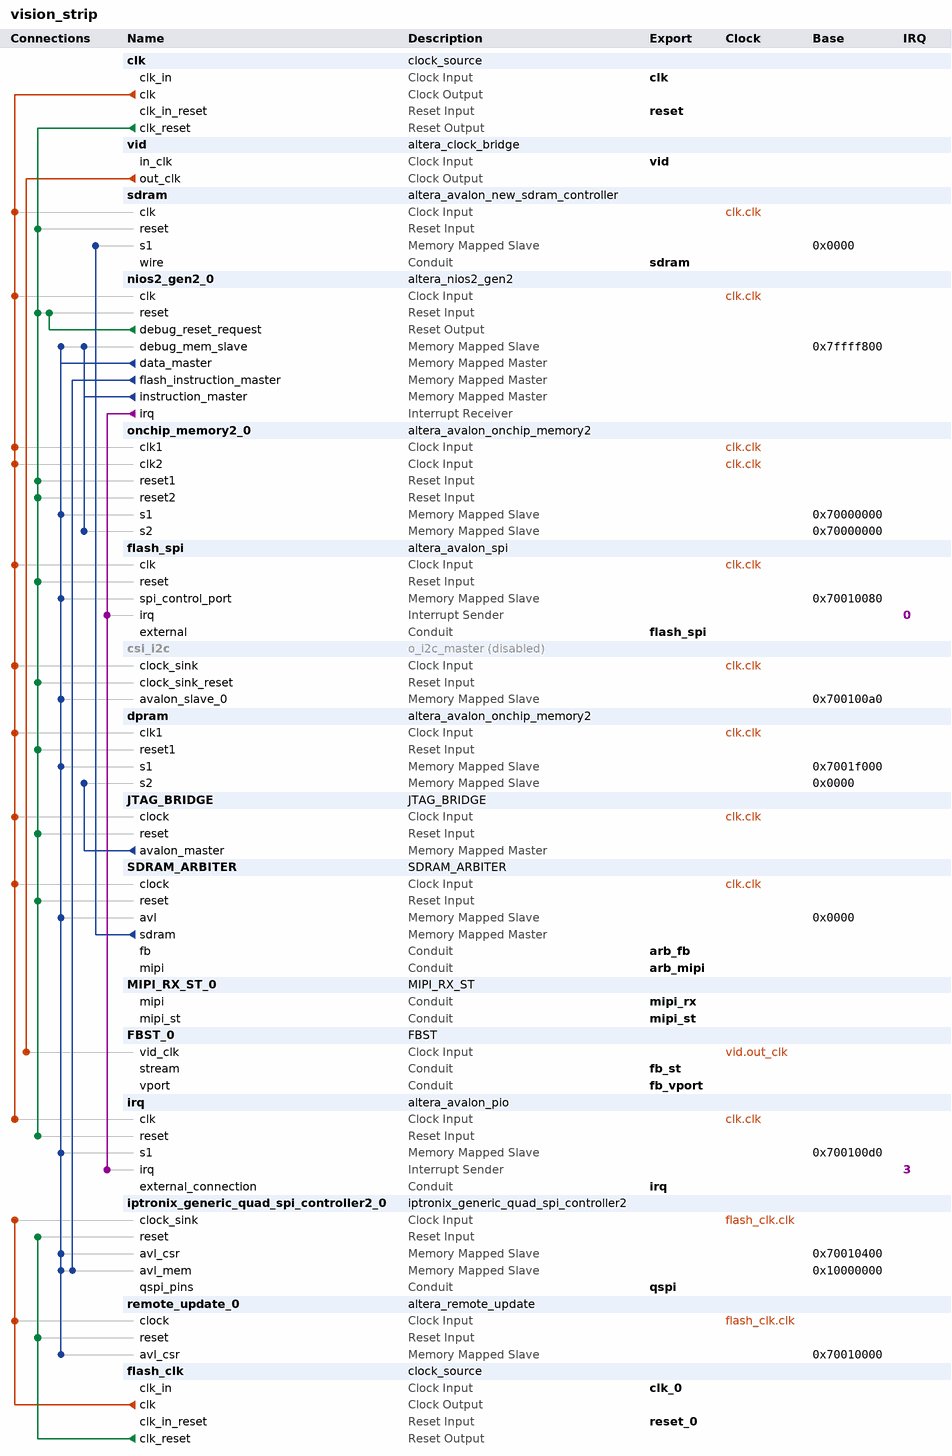
[diagram p0: system contents]
# Platform Designer (Qsys) system vision_strip, Cyclone 10 LP 10CL016YU256C8G
# Parameters at their usual value, and those the tool derives, are not listed.
package require -exact qsys 18.0
create_system vision_strip
set_project_property DEVICE_FAMILY {Cyclone 10 LP}
set_project_property DEVICE 10CL016YU256C8G

add_instance clk clock_source 18.0
set_instance_parameter_value clk clockFrequency 100000000

add_instance vid altera_clock_bridge 18.0
set_instance_parameter_value vid DERIVED_CLOCK_RATE 0
set_instance_parameter_value vid EXPLICIT_CLOCK_RATE 0

add_instance sdram altera_avalon_new_sdram_controller 18.0
set_instance_parameter_value sdram TAC 5.4
set_instance_parameter_value sdram TRCD 20.0
set_instance_parameter_value sdram TRP 20.0
set_instance_parameter_value sdram casLatency 2
set_instance_parameter_value sdram columnWidth 8
set_instance_parameter_value sdram dataWidth 16
set_instance_parameter_value sdram generateSimulationModel false
set_instance_parameter_value sdram model single_Micron_MT48LC4M32B2_7_chip
set_instance_parameter_value sdram numberOfBanks 4
set_instance_parameter_value sdram numberOfChipSelects 1
set_instance_parameter_value sdram powerUpDelay 200.0
set_instance_parameter_value sdram refreshPeriod 31.25
set_instance_parameter_value sdram rowWidth 12

add_instance nios2_gen2_0 altera_nios2_gen2 18.0
set_instance_parameter_value nios2_gen2_0 dcache_size 1024
set_instance_parameter_value nios2_gen2_0 debug_hwbreakpoint 4
set_instance_parameter_value nios2_gen2_0 exceptionSlave onchip_memory2_0.s2
set_instance_parameter_value nios2_gen2_0 fa_cache_linesize 16
set_instance_parameter_value nios2_gen2_0 icache_size 1024
set_instance_parameter_value nios2_gen2_0 impl Fast
set_instance_parameter_value nios2_gen2_0 resetSlave onchip_memory2_0.s2

add_instance onchip_memory2_0 altera_avalon_onchip_memory2 18.0
set_instance_parameter_value onchip_memory2_0 dataWidth 32
set_instance_parameter_value onchip_memory2_0 dualPort true
set_instance_parameter_value onchip_memory2_0 initMemContent true
set_instance_parameter_value onchip_memory2_0 initializationFileName onchip_mem.hex
set_instance_parameter_value onchip_memory2_0 memorySize 16384

add_instance flash_spi altera_avalon_spi 18.0
set_instance_parameter_value flash_spi clockPolarity 0
set_instance_parameter_value flash_spi dataWidth 8
set_instance_parameter_value flash_spi masterSPI true
set_instance_parameter_value flash_spi numberOfSlaves 1
set_instance_parameter_value flash_spi targetClockRate 50000000

add_instance csi_i2c o_i2c_master 1.0
set_instance_property csi_i2c ENABLED false

add_instance dpram altera_avalon_onchip_memory2 18.0
set_instance_parameter_value dpram dataWidth 32
set_instance_parameter_value dpram dualPort true
set_instance_parameter_value dpram initMemContent true
set_instance_parameter_value dpram initializationFileName onchip_mem.hex
set_instance_parameter_value dpram memorySize 1024
set_instance_parameter_value dpram singleClockOperation true

add_instance JTAG_BRIDGE JTAG_BRIDGE 1.0

add_instance SDRAM_ARBITER SDRAM_ARBITER 1.0
set_instance_parameter_value SDRAM_ARBITER pADDRESS_BITS 22
set_instance_parameter_value SDRAM_ARBITER pBURST_SIZE 128
set_instance_parameter_value SDRAM_ARBITER pCAM_OFFSET_A 0
set_instance_parameter_value SDRAM_ARBITER pCAM_OFFSET_B 307200
set_instance_parameter_value SDRAM_ARBITER pFB_OFFSET 614400
set_instance_parameter_value SDRAM_ARBITER pFB_SIZE 307200

add_instance MIPI_RX_ST_0 MIPI_RX_ST 1.0

add_instance FBST_0 FBST 1.0
set_instance_parameter_value FBST_0 pHRES 640
set_instance_parameter_value FBST_0 pHSE 752
set_instance_parameter_value FBST_0 pHSS 656
set_instance_parameter_value FBST_0 pHTOTAL 762
set_instance_parameter_value FBST_0 pVRES 480
set_instance_parameter_value FBST_0 pVSE 492
set_instance_parameter_value FBST_0 pVSS 490
set_instance_parameter_value FBST_0 pVTOTAL 525

add_instance irq altera_avalon_pio 18.0
set_instance_parameter_value irq captureEdge true
set_instance_parameter_value irq direction InOut
set_instance_parameter_value irq generateIRQ true
set_instance_parameter_value irq irqType EDGE
set_instance_parameter_value irq width 3

add_instance iptronix_generic_quad_spi_controller2_0 iptronix_generic_quad_spi_controller2 18.0
set_instance_parameter_value iptronix_generic_quad_spi_controller2_0 ATOM UNIDIRECTIONAL
set_instance_parameter_value iptronix_generic_quad_spi_controller2_0 CHIP_SELS 1
set_instance_parameter_value iptronix_generic_quad_spi_controller2_0 FLASH_TYPE N25Q16
set_instance_parameter_value iptronix_generic_quad_spi_controller2_0 IO_MODE QUAD
set_instance_parameter_value iptronix_generic_quad_spi_controller2_0 clkFreq 40000000

add_instance remote_update_0 altera_remote_update 18.0
set_instance_parameter_value remote_update_0 CBX_AUTO_BLACKBOX ALL
set_instance_parameter_value remote_update_0 DEVICE 10CL016YU256C8G
set_instance_parameter_value remote_update_0 GUI_config_device EPCS16
set_instance_parameter_value remote_update_0 check_app_pof false
set_instance_parameter_value remote_update_0 check_avalon_interface true
set_instance_parameter_value remote_update_0 m_support_write_config_check true
set_instance_parameter_value remote_update_0 operation_mode REMOTE

add_instance flash_clk clock_source 18.0
set_instance_parameter_value flash_clk clockFrequency 40000000

# connections
add_connection clk.clk csi_i2c.clock_sink clock
add_connection clk.clk dpram.clk1 clock
add_connection clk.clk flash_spi.clk clock
add_connection clk.clk irq.clk clock
add_connection clk.clk JTAG_BRIDGE.clock clock
add_connection clk.clk nios2_gen2_0.clk clock
add_connection clk.clk onchip_memory2_0.clk1 clock
add_connection clk.clk onchip_memory2_0.clk2 clock
add_connection clk.clk sdram.clk clock
add_connection clk.clk SDRAM_ARBITER.clock clock
add_connection flash_clk.clk iptronix_generic_quad_spi_controller2_0.clock_sink clock
add_connection flash_clk.clk remote_update_0.clock clock
add_connection vid.out_clk FBST_0.vid_clk clock
add_connection clk.clk_reset csi_i2c.clock_sink_reset reset
add_connection clk.clk_reset dpram.reset1 reset
add_connection clk.clk_reset flash_spi.reset reset
add_connection clk.clk_reset irq.reset reset
add_connection clk.clk_reset JTAG_BRIDGE.reset reset
add_connection clk.clk_reset nios2_gen2_0.reset reset
add_connection clk.clk_reset onchip_memory2_0.reset1 reset
add_connection clk.clk_reset onchip_memory2_0.reset2 reset
add_connection clk.clk_reset sdram.reset reset
add_connection clk.clk_reset SDRAM_ARBITER.reset reset
add_connection flash_clk.clk_reset iptronix_generic_quad_spi_controller2_0.reset reset
add_connection flash_clk.clk_reset remote_update_0.reset reset
add_connection nios2_gen2_0.debug_reset_request nios2_gen2_0.reset reset
add_connection JTAG_BRIDGE.avalon_master dpram.s2 avalon
set_connection_parameter_value JTAG_BRIDGE.avalon_master/dpram.s2 baseAddress 0x0000
add_connection nios2_gen2_0.data_master csi_i2c.avalon_slave_0 avalon
set_connection_parameter_value nios2_gen2_0.data_master/csi_i2c.avalon_slave_0 baseAddress 0x700100a0
add_connection nios2_gen2_0.data_master dpram.s1 avalon
set_connection_parameter_value nios2_gen2_0.data_master/dpram.s1 baseAddress 0x7001f000
add_connection nios2_gen2_0.data_master flash_spi.spi_control_port avalon
set_connection_parameter_value nios2_gen2_0.data_master/flash_spi.spi_control_port baseAddress 0x70010080
add_connection nios2_gen2_0.data_master iptronix_generic_quad_spi_controller2_0.avl_csr avalon
set_connection_parameter_value nios2_gen2_0.data_master/iptronix_generic_quad_spi_controller2_0.avl_csr baseAddress 0x70010400
add_connection nios2_gen2_0.data_master iptronix_generic_quad_spi_controller2_0.avl_mem avalon
set_connection_parameter_value nios2_gen2_0.data_master/iptronix_generic_quad_spi_controller2_0.avl_mem baseAddress 0x10000000
add_connection nios2_gen2_0.data_master irq.s1 avalon
set_connection_parameter_value nios2_gen2_0.data_master/irq.s1 baseAddress 0x700100d0
add_connection nios2_gen2_0.data_master nios2_gen2_0.debug_mem_slave avalon
set_connection_parameter_value nios2_gen2_0.data_master/nios2_gen2_0.debug_mem_slave baseAddress 0x7ffff800
add_connection nios2_gen2_0.data_master onchip_memory2_0.s1 avalon
set_connection_parameter_value nios2_gen2_0.data_master/onchip_memory2_0.s1 baseAddress 0x70000000
add_connection nios2_gen2_0.data_master remote_update_0.avl_csr avalon
set_connection_parameter_value nios2_gen2_0.data_master/remote_update_0.avl_csr baseAddress 0x70010000
add_connection nios2_gen2_0.data_master SDRAM_ARBITER.avl avalon
set_connection_parameter_value nios2_gen2_0.data_master/SDRAM_ARBITER.avl baseAddress 0x0000
add_connection nios2_gen2_0.flash_instruction_master iptronix_generic_quad_spi_controller2_0.avl_mem avalon
set_connection_parameter_value nios2_gen2_0.flash_instruction_master/iptronix_generic_quad_spi_controller2_0.avl_mem baseAddress 0x10000000
add_connection nios2_gen2_0.instruction_master nios2_gen2_0.debug_mem_slave avalon
set_connection_parameter_value nios2_gen2_0.instruction_master/nios2_gen2_0.debug_mem_slave baseAddress 0x7ffff800
add_connection nios2_gen2_0.instruction_master onchip_memory2_0.s2 avalon
set_connection_parameter_value nios2_gen2_0.instruction_master/onchip_memory2_0.s2 baseAddress 0x70000000
add_connection SDRAM_ARBITER.sdram sdram.s1 avalon
set_connection_parameter_value SDRAM_ARBITER.sdram/sdram.s1 baseAddress 0x0000
add_connection nios2_gen2_0.irq flash_spi.irq interrupt
set_connection_parameter_value nios2_gen2_0.irq/flash_spi.irq irqNumber 0
add_connection nios2_gen2_0.irq irq.irq interrupt
set_connection_parameter_value nios2_gen2_0.irq/irq.irq irqNumber 3

# exported interfaces
add_interface arb_fb conduit end
set_interface_property arb_fb EXPORT_OF SDRAM_ARBITER.fb
add_interface arb_mipi conduit end
set_interface_property arb_mipi EXPORT_OF SDRAM_ARBITER.mipi
add_interface clk clock sink
set_interface_property clk EXPORT_OF clk.clk_in
add_interface clk_0 clock sink
set_interface_property clk_0 EXPORT_OF flash_clk.clk_in
add_interface fb_st conduit end
set_interface_property fb_st EXPORT_OF FBST_0.stream
add_interface fb_vport conduit end
set_interface_property fb_vport EXPORT_OF FBST_0.vport
add_interface flash_spi conduit end
set_interface_property flash_spi EXPORT_OF flash_spi.external
add_interface irq conduit end
set_interface_property irq EXPORT_OF irq.external_connection
add_interface mipi_rx conduit end
set_interface_property mipi_rx EXPORT_OF MIPI_RX_ST_0.mipi
add_interface mipi_st conduit end
set_interface_property mipi_st EXPORT_OF MIPI_RX_ST_0.mipi_st
add_interface qspi conduit end
set_interface_property qspi EXPORT_OF iptronix_generic_quad_spi_controller2_0.qspi_pins
add_interface reset reset sink
set_interface_property reset EXPORT_OF clk.clk_in_reset
add_interface reset_0 reset sink
set_interface_property reset_0 EXPORT_OF flash_clk.clk_in_reset
add_interface sdram conduit end
set_interface_property sdram EXPORT_OF sdram.wire
add_interface vid clock sink
set_interface_property vid EXPORT_OF vid.in_clk

set_interconnect_requirement {$system} qsys_mm.clockCrossingAdapter HANDSHAKE
set_interconnect_requirement {$system} qsys_mm.enableEccProtection FALSE
set_interconnect_requirement {$system} qsys_mm.insertDefaultSlave FALSE
set_interconnect_requirement {$system} qsys_mm.maxAdditionalLatency 1

save_system vision_strip.qsys
